# Altium schematic sheet LPF_PA.SchDoc
size A; SheetNumber: 2; SheetTotal: 7
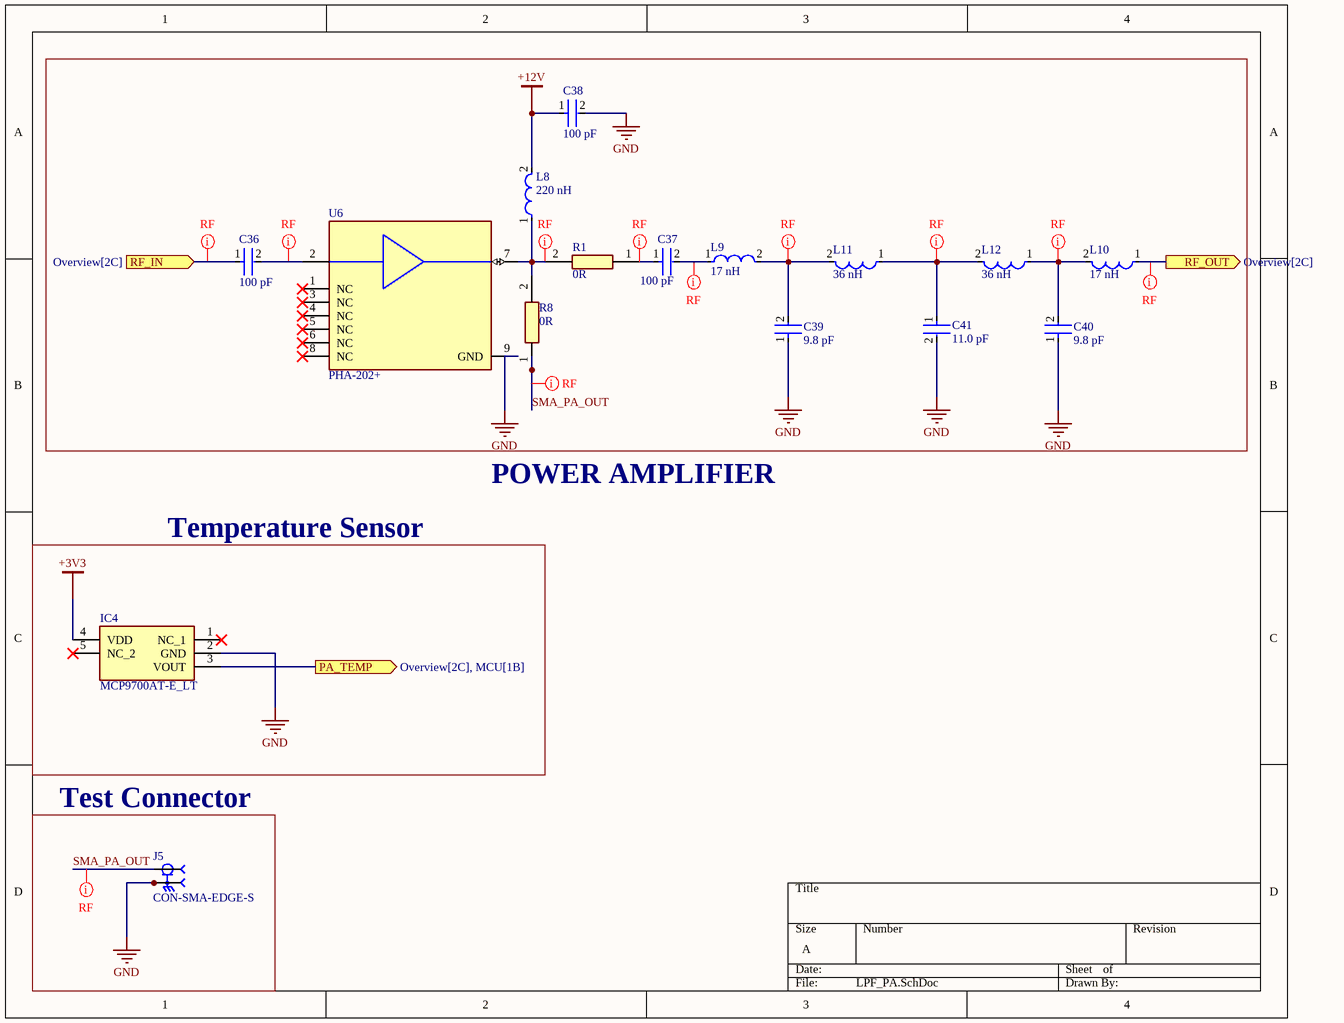
[diagram p0: LPF_PA.SchDoc]

## Parts
C36  100 pF  [FP-GQM187-0_15-MFG]
C37  100 pF  [FP-GQM187-0_15-MFG]
C38  100 pF  [FP-GQM187-0_15-MFG]
C39  9.8 pF  [FP-GJM155-0_05-IPC_A]
C40  9.8 pF  [FP-GJM155-0_05-IPC_A]
C41  11.0 pF  [FP-GJM155-0_05-IPC_B]
IC4  MCP9700AT-E_LT  [SOT65P210X110-5N]
J5  CON-SMA-EDGE-S  [RFSOLUTIONS_CON-SMA-EDGE-S]
L8  220 nH  [FP-LQW18AN_80-MFG]
L9  17 nH  [FP-LQW18AN_80-MFG]
L10  17 nH  [FP-LQW18AN_80-MFG]
L11  36 nH  [FP-LQW18AN_80-MFG]
L12  36 nH  [FP-LQW18AN_80-MFG]
R1  0R  [RESC1608X55N]
R8  0R  [RESC1608X55N]
U6  PHA-202+  [FP-DL1636-MFG]

## Blocks framed on the sheet
Temperature Sensor: IC4
Test Connector: J5

## Ports
PA_TEMP (out, see Overview[2C], MCU[1B]), RF_IN (in, see Overview[2C]), RF_OUT (out, see Overview[2C])

## Nets
+3V3: IC4.4(VDD)
+12V: C38.1 L8.2
GND: C38.2 C39.1 C40.1 C41.2 IC4.2(GND) J5.G1 J5.G2 J5.G3 J5.G4 U6.9(GND)
PA_TEMP: IC4.3(VOUT) ; port PA_TEMP
RF_IN: C36.1 ; port RF_IN
RF_OUT: L10.1 ; port RF_OUT
SMA_PA_OUT: J5.1 R8.1
NetC36_2: C36.2 U6.2(RF-IN)
NetC37_1: C37.1 R1.1
NetC37_2: C37.2 L9.1
NetC39_2: C39.2 L9.2 L11.2
NetC40_2: C40.2 L10.2 L12.1
NetC41_1: C41.1 L11.1 L12.2
NetL8_1: L8.1 R1.2 R8.2 U6.7(RF-OUT&DC-IN)

Not connected (* = marked no-connect by the designer): IC4 1(NC_1)* 5(NC_2)*; U6 1(NC)* 3(NC)* 4(NC)* 5(NC)* 6(NC)* 8(NC)*

## Layout directives
rule Impedance Constraint [Min = 50.00    Max = 50.00    ]; net class RF: NetC36_2, NetC37_1, NetC37_2, NetC39_2, NetC40_2, NetC41_1, NetL8_1, RF_IN, RF_OUT, SMA_PA_OUT

## Notes on the sheet
- POWER AMPLIFIER

## Library data of the parts
C36-C38 = CMP-06035-018516-1: Ceramic Capacitor 100pF ±5% 250VDC C0G 0603 Paper T/R Name: GQM1875C2E101JB12D; Voltage Rating (DC): 250V; Min Operating Temperature: -55°C; Case Code (Metric): 1608; Lead Free: Lead Free; Length: 1.6mm; Voltage Rating: 250V; Termination: SMD/SMT; Packaging: Tape and Reel; Width: 0.031inch; Tolerance: 5%; Thickness: 0.031inch; Capacitance: 100pF; Package Quantity: 4000; Case/Package: 0603; Mount: Surface Mount; Max Operating Temperature: 125°C; Dielectric: C0G; Depth: 0.8mm; Case Code (Imperial): 0603
C39 C40 = CMP-2008-03896-2: Multi-Layer Ceramic Capacitor 9.8pF C0G  ±0.05pF 0402 Paper T/R Name: GJM1555C1H9R8WB01D; Voltage Rating: 50V; Package Quantity: 10000; Termination: SMD/SMT; Min Operating Temperature: -55°C; Case/Package: 0402; Case Code (Imperial): 0402; Width: 0.02inch; Case Code (Metric): 1005; Height: 0.5mm; Max Operating Temperature: 125°C; Depth: 0.5mm; Dielectric: C0G; Thickness: 0.022inch; Capacitance: 9.8pF; Mount: Surface Mount; Length: 1mm; Packaging: Tape and Reel; Voltage Rating (DC): 50V; Radiation Hardening: No
C41 = CMP-2008-03798-2: Multi-Layer Ceramic Capacitor 11pF C0G  ±2% 0402 Paper T/R Name: GJM1555C1H110GB01D; Voltage Rating (DC): 50V; Dielectric: C0G; Case/Package: 0402; Mount: Surface Mount; Case Code (Imperial): 0402; Case Code (Metric): 1005; Max Operating Temperature: 125°C; Capacitance: 11pF; Height: 0.5mm; Depth: 0.5mm; Voltage Rating: 50V; Thickness: 0.022inch; Tolerance: 2%; Width: 0.5mm; Packaging: Tape and Reel; Termination: SMD/SMT; Min Operating Temperature: -55°C; Package Quantity: 10000; Lead Free: Lead Free; Length: 1mm; Radiation Hardening: No
IC4 = MCP9700AT-E_LT: Integrated Circuit; Manufacturer_Name: Microchip; Manufacturer_Part_Number: MCP9700AT-E/LT; Datasheet Link: https://datasheet.datasheetarchive.com/originals/distributors/SFDatasheet-4/sf-00090116.pdf; Height: 1.1mm; Mouser Part Number: 579-MCP9700AT-E/LT; Mouser Price/Stock: https://www.mouser.co.uk/ProductDetail/Microchip-Technology/MCP9700AT-E-LT?qs=RnzODY3cU8v4O6DkGIhmqg%3D%3D; Arrow Part Number: MCP9700AT-E/LT; Arrow Price/Stock: https://www.arrow.com/en/products/mcp9700at-elt/microchip-technology?utm_currency=USD&region=nac
J5 = CMP-002-00088-1: SMA Connector Jack, Female Socket - Board Edge, End Launch Solder; MF: RF Solutions; Source: CON-SMA-EDGE-S.SchLib; Check_prices: https://www.snapeda.com/parts/CON-SMA-EDGE-S/RF+Solutions/view-part/?ref=eda; Component Type: Standard; Purchase-URL: https://pricing.snapeda.com/search/part/CON-SMA-EDGE-S/?ref=eda; MP: CON-SMA-EDGE-S; SnapEDA_Link: https://www.snapeda.com/parts/CON-SMA-EDGE-S/RF+Solutions/view-part/?ref=snap; Pins: 5; Case/Package: None; Value: *; Digi-Key_Part_Number: CON-SMA-EDGE-S-ND; Design Item ID: CON-SMA-EDGE-S
L8 = CMP-06042-006715-1: Wire Wound RF Inductor for Automotive 220nH ±5% 280mA 2.08Ω 0603 (1608) Name: LQW18ANR22J8ZD
L9 L10 = CMP-06042-009310-1: Wire Wound RF Inductor for Automotive 17nH ±2% 1400mA 0.075Ω 0603 (1608) Name: LQW18AN17NG8ZD
L11 L12 = CMP-06042-006264-1: Wire Wound RF Inductor for Automotive 36nH ±5% 910mA 0.2Ω 0603 (1608) Name: LQW18AN36NJ8ZD
R1 R8 = RC0603JR-070RL: Manufacturer_Name: Yageo Group; Datasheet Link: http://www.yageo.com/documents/recent/PYu-RC0603_51_RoHS_L_v5.pdf; Height: 0.55mm; Manufacturer_Part_Number: RC0603JR-070RL; Mouser Part Number: 603-RC0603JR-070RL; Mouser Price/Stock: https://www.mouser.co.uk/ProductDetail/YAGEO/RC0603JR-070RL?qs=2cAdsCoAWRGWyPcuXgGiXQ%3D%3D; Arrow Part Number: RC0603JR-070RL; Arrow Price/Stock: https://www.arrow.com/en/products/rc0603jr-070rl/yageo?utm_currency=USD&region=nac
U6 = CMP-199891-000001-1: Ultra High Dynamic Range Monolithic Amplifier; Manufacturer: Mini-Circuits; Max Power Dissipation: 5.8W; Max Junction Temp: +179°C; Bandwidth: 0.03-2.7GHz; Noise Figure: 5.4dB; P1Db: 30.4dBm; Max Frequency: 2.7GHz; Gain: 12.7dB; Nominal Supply Current: 350mA; RoHS: TRUE; Temperature: -40°C to +85°C; Device Class L1: Integrated Circuits (ICs); ComponentLink2Description: Datasheet; Category: IC; Footprint Url: https://ww3.minicircuits.com/case_style/DL1636.pdf; Device Class L3: RF Amplifiers; Temperature Range High: +85°C; Manufacturer Part Number: PHA-202+; Package: DL1636; Temperature Range Low: -40°C; Automotive: No; Lead Free: Yes; Height: 0.039inch; Device Class L2: RF Semiconductors and Devices; Octopart: https://octopart.com/pha-202%2B-mini-circuits-107467474; Ipc Land Pattern Name: DFN490X599X89-8; ComponentLink2URL: https://ww3.minicircuits.com/pdfs/PHA-202+.pdf